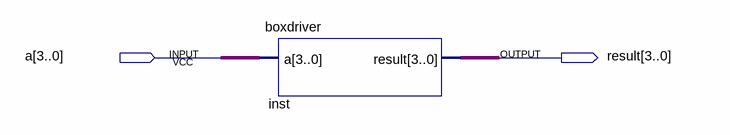
[diagram p0: schematic sheet]
// Quartus schematic flash.bdf as structural Verilog: 1 symbols, 2 pins
module flash (
  input  [3:0] a,
  output [3:0] result
);

  boxdriver inst (.a(a), .result(result));
endmodule
